# EAGLE design Design_Schematic (EAGLE 8.6.0)
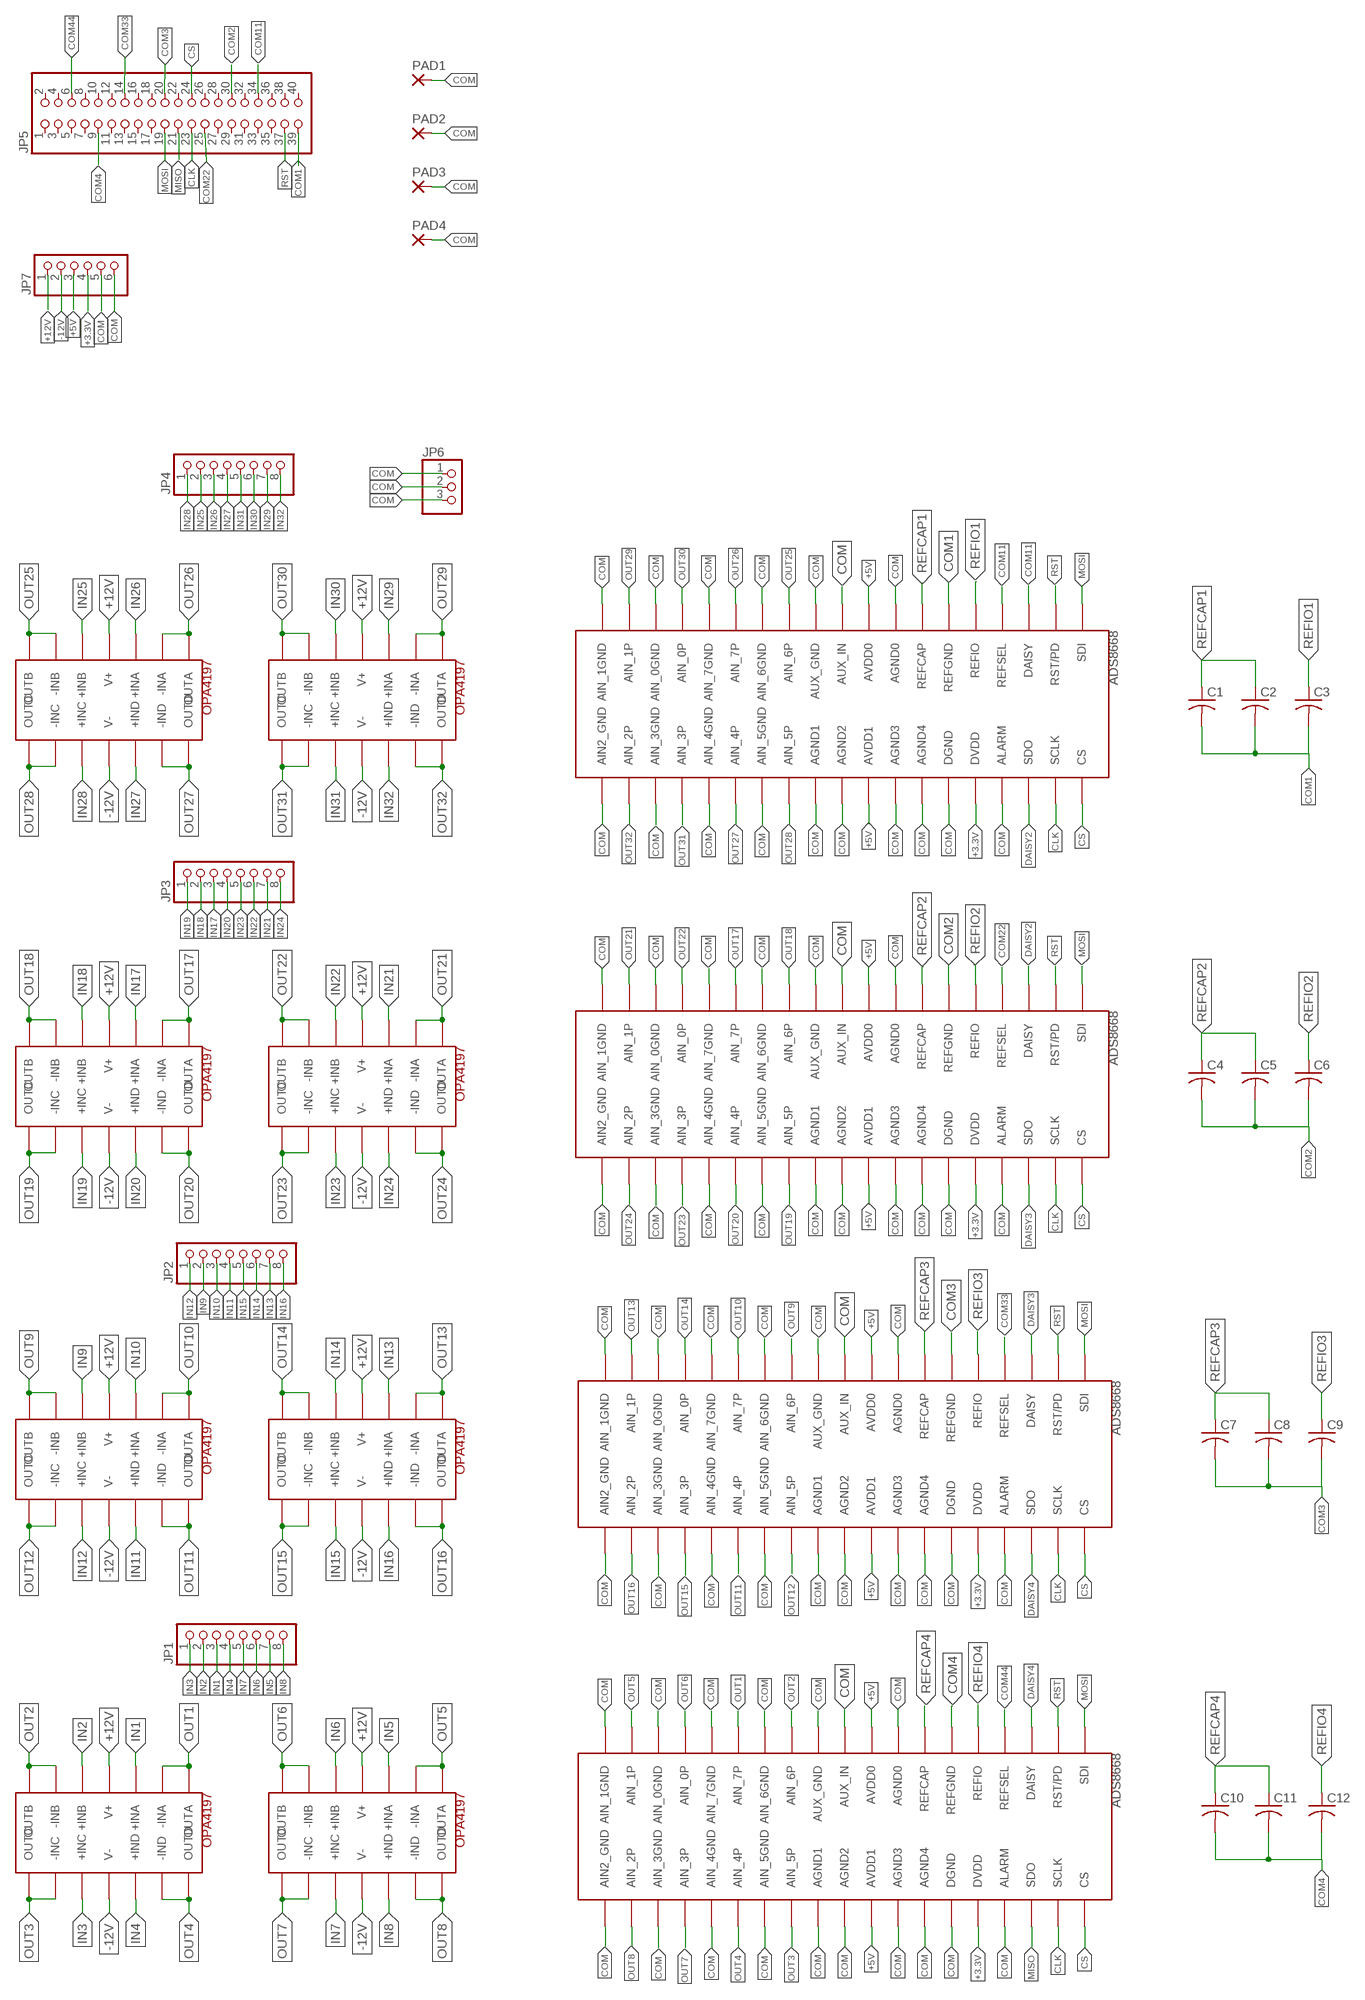
[diagram p0: schematic, sheet 1]

## Parts
ADC1  ADS8668  [ADS8668]
ADC2  ADS8668  [ADS8668]
ADC3  ADS8668  [ADS8668]
ADC4  ADS8668  [ADS8668]
C1  C-US025-030X050  [C025-030X050]
C2  C-US025-030X050  [C025-030X050]
C3  C-US025-030X050  [C025-030X050]
C4  C-US025-030X050  [C025-030X050]
C5  C-US025-030X050  [C025-030X050]
C6  C-US025-030X050  [C025-030X050]
C7  C-US025-030X050  [C025-030X050]
C8  C-US025-030X050  [C025-030X050]
C9  C-US025-030X050  [C025-030X050]
C10  C-US025-030X050  [C025-030X050]
C11  C-US025-030X050  [C025-030X050]
C12  C-US025-030X050  [C025-030X050]
JP1  PINHD-1X8CLEANBIG  [1X08-CLEANBIG]
JP2  PINHD-1X8CLEANBIG  [1X08-CLEANBIG]
JP3  PINHD-1X8CLEANBIG  [1X08-CLEANBIG]
JP4  PINHD-1X8CLEANBIG  [1X08-CLEANBIG]
JP5  PINHD-2X20  [2X20]
JP6  PINHD-1X3  [1X03]
JP7  PINHD-1X6  [1X06]
PAD1  3,17/1,3  [3,17/1,3]
PAD2  3,17/1,3  [3,17/1,3]
PAD3  3,17/1,3  [3,17/1,3]
PAD4  3,17/1,3  [3,17/1,3]
U$1  OPA4197  [OPA4197]
U$2  OPA4197  [OPA4197]
U$3  OPA4197  [OPA4197]
U$4  OPA4197  [OPA4197]
U$5  OPA4197  [OPA4197]
U$6  OPA4197  [OPA4197]
U$7  OPA4197  [OPA4197]
U$8  OPA4197  [OPA4197]

## Nets
+3.3V: ADC1.DVDD ADC2.DVDD ADC3.DVDD ADC4.DVDD JP7.4
+5V: ADC1.AVDD0 ADC1.AVDD1 ADC2.AVDD0 ADC2.AVDD1 ADC3.AVDD0 ADC3.AVDD1 ADC4.AVDD0 ADC4.AVDD1 JP7.3
+12V: JP7.1 U$1.V+ U$2.V+ U$3.V+ U$4.V+ U$5.V+ U$6.V+ U$7.V+ U$8.V+
-12V: JP7.2 U$1.V- U$2.V- U$3.V- U$4.V- U$5.V- U$6.V- U$7.V- U$8.V-
CLK: ADC1.SCLK ADC2.SCLK ADC3.SCLK ADC4.SCLK JP5.23
COM: ADC1.AGND0 ADC1.AGND1 ADC1.AGND2 ADC1.AGND3 ADC1.AGND4 ADC1.AIN2_GND ADC1.AIN6_GND(AIN_6GND) ADC1.AIN_0GND ADC1.AIN_1GND ADC1.AIN_3GND ADC1.AIN_4GND ADC1.AIN_5GND ADC1.AIN_7GND ADC1.ALARM ADC1.AUX_GND ADC1.AUX_IN ADC1.DGND ADC2.AGND0 ADC2.AGND1 ADC2.AGND2 ADC2.AGND3 ADC2.AGND4 ADC2.AIN2_GND ADC2.AIN6_GND(AIN_6GND) ADC2.AIN_0GND ADC2.AIN_1GND ADC2.AIN_3GND ADC2.AIN_4GND ADC2.AIN_5GND ADC2.AIN_7GND ADC2.ALARM ADC2.AUX_GND ADC2.AUX_IN ADC2.DGND ADC3.AGND0 ADC3.AGND1 ADC3.AGND2 ADC3.AGND3 ADC3.AGND4 ADC3.AIN2_GND ADC3.AIN6_GND(AIN_6GND) ADC3.AIN_0GND ADC3.AIN_1GND ADC3.AIN_3GND ADC3.AIN_4GND ADC3.AIN_5GND ADC3.AIN_7GND ADC3.ALARM ADC3.AUX_GND ADC3.AUX_IN ADC3.DGND ADC4.AGND0 ADC4.AGND1 ADC4.AGND2 ADC4.AGND3 ADC4.AGND4 ADC4.AIN2_GND ADC4.AIN6_GND(AIN_6GND) ADC4.AIN_0GND ADC4.AIN_1GND ADC4.AIN_3GND ADC4.AIN_4GND ADC4.AIN_5GND ADC4.AIN_7GND ADC4.ALARM ADC4.AUX_GND ADC4.AUX_IN ADC4.DGND JP6.1 JP6.2 JP6.3 JP7.5 JP7.6 PAD1.1(P) PAD2.1(P) PAD3.1(P) PAD4.1(P)
COM1: ADC4.REFGND C1.2 C2.2 C3.2 JP5.39
COM2: ADC1.REFGND C4.2 C5.2 C6.2 JP5.30
COM3: ADC2.REFGND C7.2 C8.2 C9.2 JP5.20
COM4: ADC3.REFGND C10.2 C11.2 C12.2 JP5.9
COM11: ADC4.DAISY ADC4.REFSEL JP5.34
COM22: ADC1.REFSEL JP5.25
COM33: ADC2.REFSEL JP5.14
COM44: ADC3.REFSEL JP5.6
CS: ADC1.CS ADC2.CS ADC3.CS ADC4.CS JP5.24
DAISY2: ADC1.DAISY ADC4.SDO
DAISY3: ADC1.SDO ADC2.DAISY
DAISY4: ADC2.SDO ADC3.DAISY
IN1: JP1.3 U$5.+INA
IN2: JP1.2 U$5.+INB
IN3: JP1.1 U$5.+INC
IN4: JP1.4 U$5.+IND
IN5: JP1.7 U$1.+INA
IN6: JP1.6 U$1.+INB
IN7: JP1.5 U$1.+INC
IN8: JP1.8 U$1.+IND
IN9: JP2.2 U$2.+INB
IN10: JP2.3 U$2.+INA
IN11: JP2.4 U$2.+IND
IN12: JP2.1 U$2.+INC
IN13: JP2.7 U$3.+INA
IN14: JP2.6 U$3.+INB
IN15: JP2.5 U$3.+INC
IN16: JP2.8 U$3.+IND
IN17: JP3.3 U$4.+INA
IN18: JP3.2 U$4.+INB
IN19: JP3.1 U$4.+INC
IN20: JP3.4 U$4.+IND
IN21: JP3.7 U$6.+INA
IN22: JP3.6 U$6.+INB
IN23: JP3.5 U$6.+INC
IN24: JP3.8 U$6.+IND
IN25: JP4.2 U$7.+INB
IN26: JP4.3 U$7.+INA
IN27: JP4.4 U$7.+IND
IN28: JP4.1 U$7.+INC
IN29: JP4.7 U$8.+INA
IN30: JP4.6 U$8.+INB
IN31: JP4.5 U$8.+INC
IN32: JP4.8 U$8.+IND
MISO: ADC3.SDO JP5.21
MOSI: ADC1.SDI ADC2.SDI ADC3.SDI ADC4.SDI JP5.19
OUT1: ADC3.AIN_7P U$5.-INA U$5.OUTA
OUT2: ADC3.AIN_6P U$5.-INB U$5.OUTB
OUT3: ADC3.AIN_5P U$5.-INC U$5.OUTC
OUT4: ADC3.AIN_4P U$5.-IND U$5.OUTD
OUT5: ADC3.AIN_1P U$1.-INA U$1.OUTA
OUT6: ADC3.AIN_0P U$1.-INB U$1.OUTB
OUT7: ADC3.AIN_3P U$1.-INC U$1.OUTC
OUT8: ADC3.AIN_2P U$1.-IND U$1.OUTD
OUT9: ADC2.AIN_6P U$2.-INB U$2.OUTB
OUT10: ADC2.AIN_7P U$2.-INA U$2.OUTA
OUT11: ADC2.AIN_4P U$2.-IND U$2.OUTD
OUT12: ADC2.AIN_5P U$2.-INC U$2.OUTC
OUT13: ADC2.AIN_1P U$3.-INA U$3.OUTA
OUT14: ADC2.AIN_0P U$3.-INB U$3.OUTB
OUT15: ADC2.AIN_3P U$3.-INC U$3.OUTC
OUT16: ADC2.AIN_2P U$3.-IND U$3.OUTD
OUT17: ADC1.AIN_7P U$4.-INA U$4.OUTA
OUT18: ADC1.AIN_6P U$4.-INB U$4.OUTB
OUT19: ADC1.AIN_5P U$4.-INC U$4.OUTC
OUT20: ADC1.AIN_4P U$4.-IND U$4.OUTD
OUT21: ADC1.AIN_1P U$6.-INA U$6.OUTA
OUT22: ADC1.AIN_0P U$6.-INB U$6.OUTB
OUT23: ADC1.AIN_3P U$6.-INC U$6.OUTC
OUT24: ADC1.AIN_2P U$6.-IND U$6.OUTD
OUT25: ADC4.AIN_6P U$7.-INB U$7.OUTB
OUT26: ADC4.AIN_7P U$7.-INA U$7.OUTA
OUT27: ADC4.AIN_4P U$7.-IND U$7.OUTD
OUT28: ADC4.AIN_5P U$7.-INC U$7.OUTC
OUT29: ADC4.AIN_1P U$8.-INA U$8.OUTA
OUT30: ADC4.AIN_0P U$8.-INB U$8.OUTB
OUT31: ADC4.AIN_3P U$8.-INC U$8.OUTC
OUT32: ADC4.AIN_2P U$8.-IND U$8.OUTD
REFCAP1: ADC4.REFCAP C1.1 C2.1
REFCAP2: ADC1.REFCAP C4.1 C5.1
REFCAP3: ADC2.REFCAP C7.1 C8.1
REFCAP4: ADC3.REFCAP C10.1 C11.1
REFIO1: ADC4.REFIO C3.1
REFIO2: ADC1.REFIO C6.1
REFIO3: ADC2.REFIO C9.1
REFIO4: ADC3.REFIO C12.1
RST: ADC1.RST/PD ADC2.RST/PD ADC3.RST/PD ADC4.RST/PD JP5.37
Unconnected: JP5.1 JP5.2 JP5.3 JP5.4 JP5.5 JP5.7 JP5.8 JP5.10 JP5.11 JP5.12 JP5.13 JP5.15 JP5.16 JP5.17 JP5.18 JP5.22 JP5.26 JP5.27 JP5.28 JP5.29 JP5.31 JP5.32 JP5.33 JP5.35 JP5.36 JP5.38 JP5.40

## Library data of the parts
ADC1-ADC4 = Design_Project:ADS8668: ADS8668 Analog Digital Converter - 8 Channels - 12 Bits of Resolution
C1-C12 = adafruit:C-US: CAPACITOR, American symbol
JP1-JP4 = adafruit:PINHD-1X8: PIN HEADER
JP5 = adafruit:PINHD-2X20: PIN HEADER
JP6 = adafruit:PINHD-1X3: PIN HEADER
JP7 = adafruit:PINHD-1X6: PIN HEADER
PAD1-PAD4 = wirepad:3,17/1,3: THROUGH-HOLE PAD
U$1-U$8 = Design_Project:OPA4197

## Board
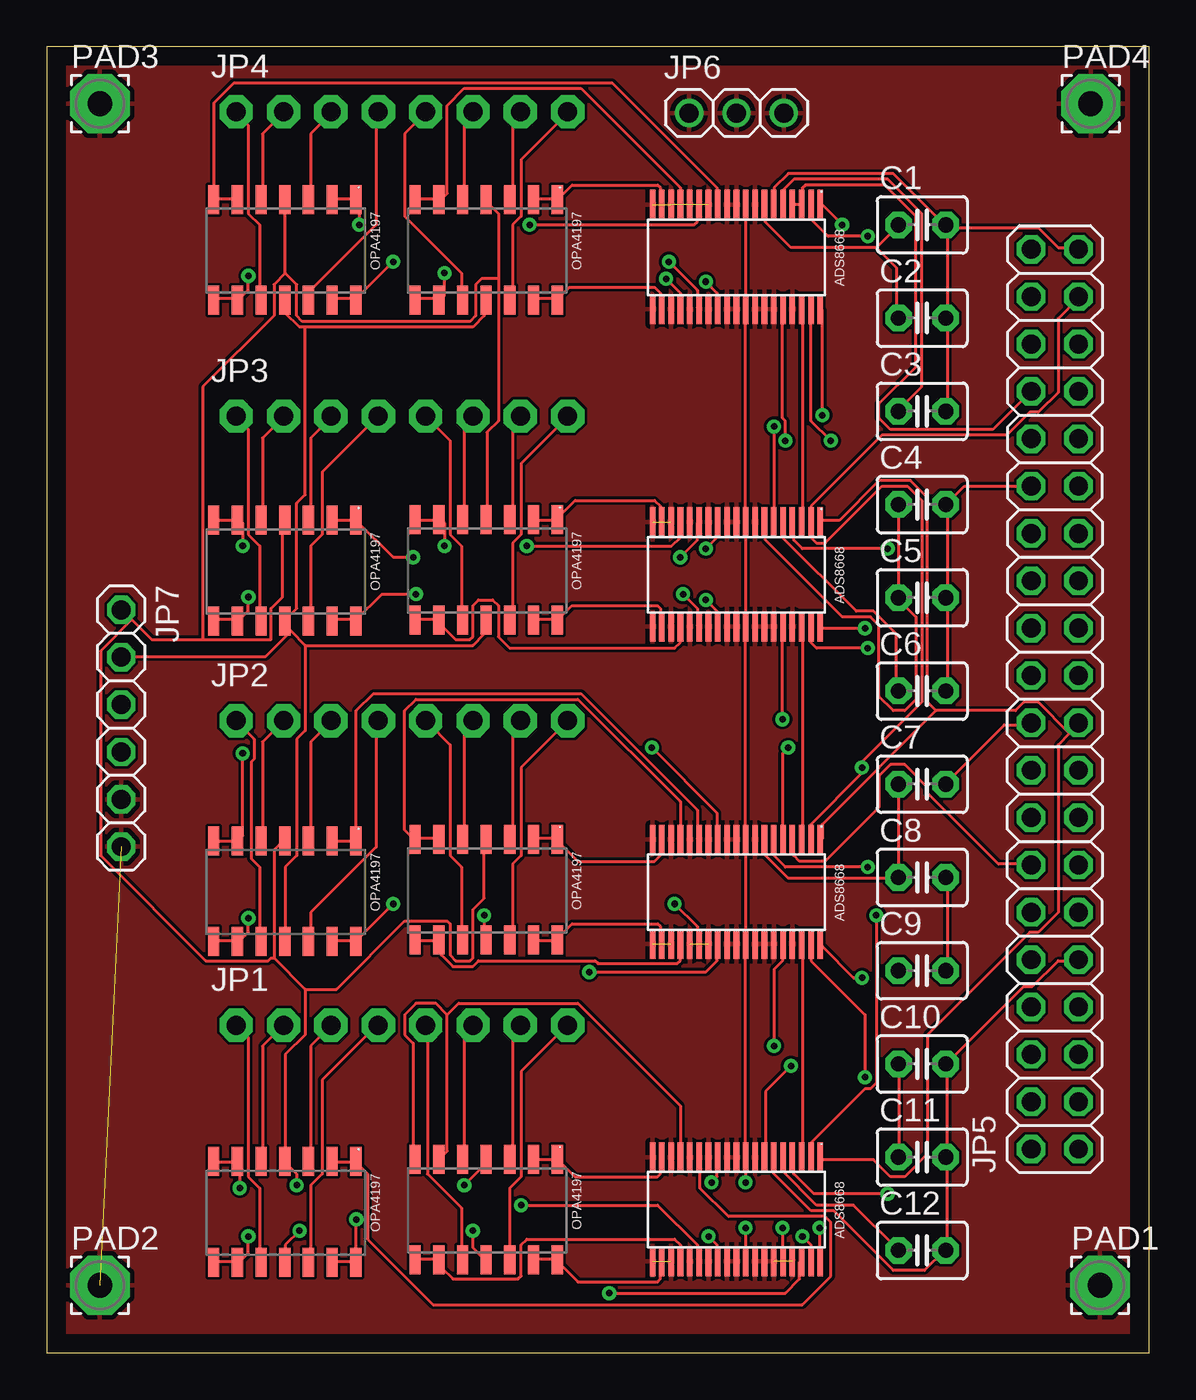
[diagram p1: board, top side]
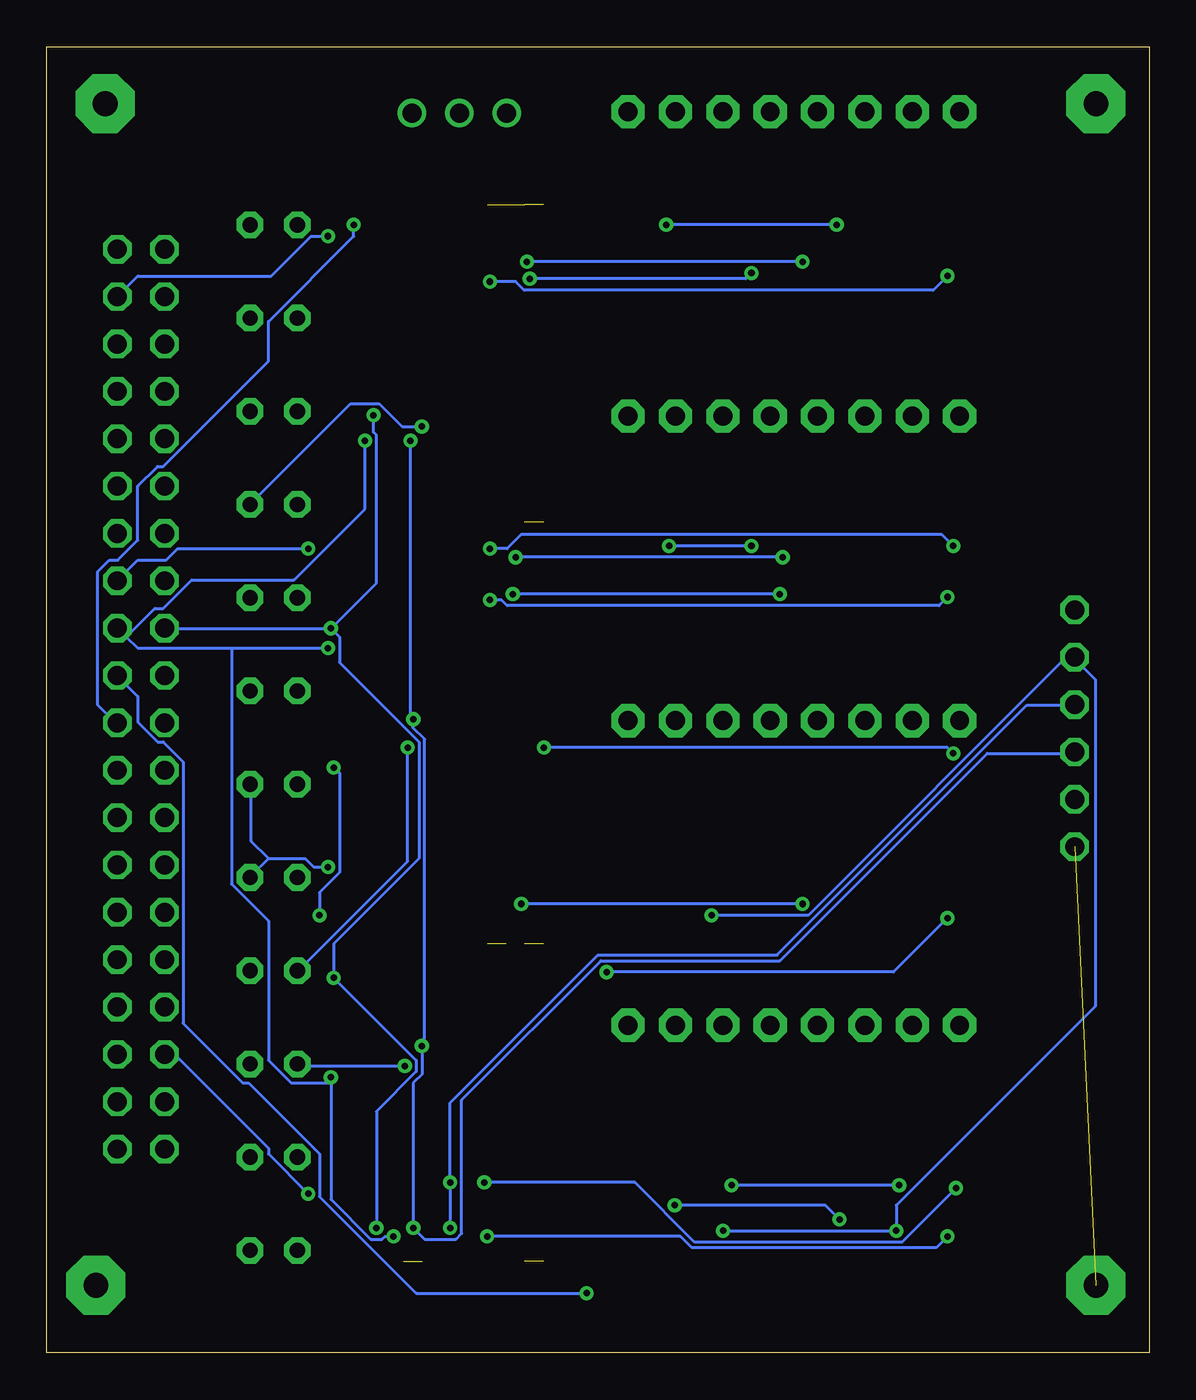
[diagram p2: board, bottom side, seen from below]

Size 59.14 x 70.06 mm. Coordinates in mm from the lower left corner, seen from the top.
Outline: 0,0 59.14,0 59.14,70.06 0,70.06 0,0
Copper layers (1+16): Top 0.035mm / dielectric 1.5mm / Bottom 0.035mm
Design rules "default *": minimum track width 6mil, minimum drill 0.35mm, track to track 6mil, track to pad 6mil, pad to pad 6mil, via to via 6mil, smd to smd 6mil, copper to edge 40mil, drill to drill 6mil, minimum pad ring 10mil, minimum via ring 8mil, stop-mask expansion 4mil, vias tented up to drill 0mil, thermal gap 10mil
vRestrict: area 8,61.5 to 17.5,63; area 8.1,55 to 17.5,56.8; area 19,61.5 to 28.2,63.1; area 18.9,55 to 28.4,56.8; area 8.1,44.3 to 17.6,46; area 8.2,38 to 17.5,39.6; area 19,44.3 to 28.2,46.1; area 18.9,37.8 to 28.5,39.8; area 8.2,27.1 to 17.6,28.8; area 18.9,27.1 to 28.2,29; area 8.1,20.3 to 17.7,22.4; area 18.8,20.4 to 28.5,22.5; 84 more areas

### Footprints (pad centres in the part's own frame; a part is rotated, then mirrored left to right if it is on the bottom)
ADS8668 = smd 0.3 x 1.6: AGND0 3.5,0; AGND1 5,5.6; AGND2 4.5,5.6; AGND3 3.5,5.6; AGND4 3,5.6; AIN2_GND 9,5.6; AIN6_GND 6,0; AIN_0GND 8,0; AIN_0P 7.5,0; AIN_1GND 9,0; AIN_1P 8.5,0; AIN_2P 8.5,5.6; AIN_3GND 8,5.6; AIN_3P 7.5,5.6; AIN_4GND 7,5.6; AIN_4P 6.5,5.6; AIN_5GND 6,5.6; AIN_5P 5.5,5.6; AIN_6P 5.5,0; AIN_7GND 7,0; AIN_7P 6.5,0; ALARM 1.5,5.6; AUX_GND 5,0; AUX_IN 4.5,0; AVDD0 4,0; AVDD1 4,5.6; CS 0,5.6; DAISY 1,0; DGND 2.5,5.6; DVDD 2,5.6; REFCAP 3,0; REFGND 2.5,0; REFIO 2,0; REFSEL 1.5,0; RST/PD 0.5,0; SCLK 0.5,5.6; SDI 0,0; SDO 1,5.6
C025-030X050 = drill 0.813 pad 1.422 octagon: 1 -1.27,0; 2 1.27,0
1X08-CLEANBIG = drill 1.016 pad 1.778 octagon: 1 -8.89,0; 2 -6.35,0; 3 -3.81,0; 4 -1.27,0; 5 1.27,0; 6 3.81,0; 7 6.35,0; 8 8.89,0
2X20 = drill 1.016 octagon: 1 -24.13,-1.27; 2 -24.13,1.27; 3 -21.59,-1.27; 4 -21.59,1.27; 5 -19.05,-1.27; 6 -19.05,1.27; 7 -16.51,-1.27; 8 -16.51,1.27; 9 -13.97,-1.27; 10 -13.97,1.27; 11 -11.43,-1.27; 12 -11.43,1.27; 13 -8.89,-1.27; 14 -8.89,1.27; 15 -6.35,-1.27; 16 -6.35,1.27; 17 -3.81,-1.27; 18 -3.81,1.27; 19 -1.27,-1.27; 20 -1.27,1.27; 21 1.27,-1.27; 22 1.27,1.27; 23 3.81,-1.27; 24 3.81,1.27; 25 6.35,-1.27; 26 6.35,1.27; 27 8.89,-1.27; 28 8.89,1.27; 29 11.43,-1.27; 30 11.43,1.27; 31 13.97,-1.27; 32 13.97,1.27; 33 16.51,-1.27; 34 16.51,1.27; 35 19.05,-1.27; 36 19.05,1.27; 37 21.59,-1.27; 38 21.59,1.27; 39 24.13,-1.27; 40 24.13,1.27
1X03 = drill 1.016: 1 -2.54,0; 2 0,0; 3 2.54,0
1X06 = drill 1.016 octagon: 1 -6.35,0; 2 -3.81,0; 3 -1.27,0; 4 1.27,0; 5 3.81,0; 6 6.35,0
3,17/1,3 = drill 1.321 pad 3.175 octagon: 1 0,0
OPA4197 = smd 0.6 x 1.55: +INA 3.175,-0.508; +INB 5.715,-0.508; +INC 5.715,4.892; +IND 3.175,4.892; -INA 1.905,-0.508; -INB 6.985,-0.508; -INC 6.985,4.892; -IND 1.905,4.892; OUTA 0.635,-0.508; OUTB 8.255,-0.508; OUTC 8.255,4.892; OUTD 0.635,4.892; V+ 4.445,-0.508; V- 4.445,4.892

### Placement (x,y rotation side)
ADC1  41.5,44.55 180 top
ADC2  41.5,27.53 180 top
ADC3  41.5,10.5 180 top
ADC4  41.5,61.58 180 top
C1  46.96,60.5 0 top
C2  46.96,55.5 0 top
C3  46.96,50.5 0 top
C4  46.96,45.5 0 top
C5  46.96,40.5 0 top
C6  46.96,35.5 0 top
C7  46.96,30.5 0 top
C8  46.96,25.5 0 top
C9  46.96,20.5 0 top
C10  46.96,15.5 0 top
C11  46.96,10.5 0 top
C12  46.96,5.5 0 top
JP1  19.06,17.58 0 top
JP2  19.06,33.91 0 top
JP3  19.06,50.23 0 top
JP4  19.06,66.56 0 top
JP5  54.08,35.06 90 top
JP6  37,66.5 0 top
JP7  4,33.5 270 top
PAD1  56.5,3.63 0 top
PAD2  2.86,3.63 0 top
PAD3  2.86,67 0 top
PAD4  56,67 0 top
U$1  28.02,9.88 180 top
U$2  17.22,26.96 180 top
U$3  28.02,27.04 180 top
U$4  17.22,44.15 180 top
U$5  17.22,9.76 180 top
U$6  28.02,44.19 180 top
U$7  17.22,61.35 180 top
U$8  28.02,61.35 180 top

### Tracks (layer width: path | path; a pad name or v marks a point on that pad's centre or on a via)
+3.3V  (via drill 0.35)
  Top 0.152: v39.47,6.71 39.47,5.03 ADC3.DVDD | v39.01,16.46 39.01,20.57 39.47,21.03 39.47,21.79 ADC2.DVDD | v39.47,33.98 39.47,38.86 ADC1.DVDD | v39.62,48.92 39.62,49.99 39.47,50.14 39.47,55.93 ADC4.DVDD
  Bottom 0.152: v39.62,48.92 39.62,34.14 v39.47,33.98 39.47,33.53 38.86,32.92 38.86,16.61 v39.01,16.46 39.01,14.94 39.47,14.48 v39.47,6.71 38.86,6.1 37.19,6.1 36.88,6.4 36.88,13.56 29.41,21.03 19.81,21.03 8.69,32.16 4.12,32.16 JP7.4
+5V  (via drill 0.35)
  Top 0.152: ADC4.AVDD0 37.49,56.08 ADC4.AVDD1 37.49,55.93 37.49,44.65 ADC1.AVDD0 37.49,44.5 37.49,39.01 ADC1.AVDD1 37.49,38.86 37.49,27.58 ADC2.AVDD0 37.49,27.43 37.49,21.95 ADC2.AVDD1 37.49,21.79 37.49,10.52 ADC3.AVDD0 37.49,10.36 v37.49,9.14 | v37.49,6.71 37.49,5.03 ADC3.AVDD1
  Bottom 0.152: v37.49,6.71 v37.49,9.14 37.49,13.41 29.57,21.34 19.96,21.34 6.55,34.75 4.12,34.75 JP7.3
+12V  (via drill 0.35)
  Top 0.152: 13.87,19.51 13.87,17.07 12.8,16 12.8,10.36 U$5.V+ 12.8,10.21 13.41,9.6 v13.41,8.99 | 12.19,21.18 13.87,19.51 | 12.19,21.18 12.19,26.98 12.65,27.43 U$2.V+ | v22.4,8.99 23.47,10.06 23.47,10.36 U$1.V+ | 13.87,19.51 15.54,19.51 19.2,23.16 21.49,23.16 21.64,23.01 21.64,21.34 21.95,21.03 22.71,21.03 22.86,21.18 22.86,23.77 23.47,24.38 23.47,27.43 U$3.V+ | 8.38,38.25 5.64,38.25 4.57,39.32 | 8.38,38.25 12.04,38.25 12.04,39.93 12.65,40.54 12.65,44.65 U$4.V+ | 4.57,39.32 4.12,39.78 JP7.1 | 24.23,57.61 24.23,61.11 23.62,61.72 U$8.V+ | 24.23,57.61 24.23,49.99 23.62,49.38 23.62,44.81 U$6.V+ | 12.8,57.91 12.8,61.72 U$7.V+ | 12.8,57.91 13.41,57.3 13.41,55.63 13.72,55.32 22.71,55.32 23.01,55.63 23.01,57.3 23.32,57.61 24.23,57.61 | 8.38,38.25 8.38,51.82 12.19,55.63 12.19,57.3 12.8,57.91 | 12.19,21.18 12.04,21.18 11.89,21.03 8.53,21.03 2.9,26.67 2.9,37.64 4.57,39.32
  Bottom 0.152: v13.41,8.99 v22.4,8.99
-12V  (via drill 0.35)
  Top 0.152: 13.87,55.02 22.86,55.02 23.47,55.63 23.47,56.39 U$8.V- | 13.87,55.02 13.56,55.02 12.8,55.78 12.8,56.39 U$7.V- | 13.87,37.95 13.87,33.38 13.41,32.92 13.41,26.67 12.8,26.06 12.8,22.1 U$2.V- | 13.11,38.71 12.65,39.17 U$4.V- 12.8,39.32 13.41,39.93 13.41,45.57 13.87,46.02 13.87,55.02 | 13.11,38.71 13.87,37.95 | 13.87,37.95 22.86,37.95 23.47,38.56 23.47,39.17 U$6.V- | v13.56,6.55 12.8,5.79 12.8,4.88 U$5.V- | v22.86,6.55 22.86,5.64 23.47,5.03 U$1.V- | v23.47,23.47 23.47,22.25 U$3.V- | 13.11,38.71 11.73,37.34 4.12,37.34 JP7.2
  Bottom 0.152: v22.86,6.55 v13.56,6.55 13.56,7.92 2.9,18.59 2.9,36.12 3.96,37.19 JP7.2 4.12,37.19 4.57,37.19 18.29,23.47 v23.47,23.47
CLK  (via drill 0.35)
  Top 0.152: v40.54,6.25 41,5.79 41,5.03 ADC3.SCLK | v43.89,14.78 43.89,18.14 41,21.03 41,21.79 ADC2.SCLK | v44.04,37.8 41.3,37.8 41,38.1 41,38.86 ADC1.SCLK | v42.06,48.92 41,49.99 41,55.93 ADC4.SCLK
  Bottom 0.152: v40.54,6.25 41,6.25 41.15,6.1 41.76,6.1 43.89,8.23 43.89,14.48 | 49.23,37.8 54.25,37.8 54.86,38.41 | 49.23,37.8 v44.04,37.8 | 54.86,38.41 55.32,38.86 JP5.23 54.86,38.41 | v42.06,48.92 42.06,45.26 45.87,41.45 51.36,41.45 52.88,39.93 53.34,39.93 54.86,38.41 | 43.89,14.48 46.02,14.48 47.24,15.7 47.24,23.16 49.23,25.15 49.23,37.8 | 43.89,14.48 v43.89,14.78
COM  (9 unrouted)
  pour Top: -4,72.5 -4,0 -0.5,-3.5 68.5,-3.5 68.5,72.5 67,74 65,76 0.5,76 -0.5,76
COM1
  Top 0.152: C3.2 48.31,50.6 48.31,55.47 C2.2 48.31,55.63 48.31,60.35 | ADC4.REFGND 39.01,61.72 39.01,62.48 39.78,63.25 45.41,63.25 48.16,60.5 C1.2 48.31,60.35 | 48.31,60.35 53.19,60.35 54.25,59.28 55.32,59.28 JP5.39
COM2  (via drill 0.35)
  Top 0.152: C6.2 48.31,35.51 48.31,40.39 C5.2 48.31,40.54 48.31,45.41 C4.2 48.31,45.57 49.23,46.48 52.73,46.48 JP5.30 | v39.01,49.68 39.01,44.65 ADC1.REFGND
  Bottom 0.152: v39.01,49.68 40.08,49.68 41.3,50.9 42.82,50.9 48.16,45.57 C4.2
COM3  (via drill 0.35)
  Top 0.152: v44.04,26.06 39.62,26.06 39.01,26.67 39.01,27.43 ADC2.REFGND | C9.2 48.31,20.57 48.31,25.45 C8.2 | JP5.20 52.73,33.68 51.36,33.68 48.31,30.63 C7.2
  Bottom 0.152: v44.04,26.06 44.81,26.06 45.26,26.52 47.24,26.52 | 47.24,26.52 48.16,25.6 C8.2 | 47.24,26.52 48.16,27.43 48.16,30.48 C7.2
COM4
  Top 0.152: ADC3.REFGND 39.01,10.36 39.01,9.6 41,7.62 42.22,7.62 45.41,4.42 47.09,4.42 48.16,5.49 C12.2 48.31,5.64 48.31,10.36 C11.2 48.31,10.52 48.31,15.39 C10.2 48.31,15.54 52.43,19.66 52.88,19.66 54.25,21.03 55.32,21.03 JP5.9
COM11
  Top 0.152: ADC4.REFSEL 40.08,61.57 40.39,61.57 ADC4.DAISY 40.54,61.72 40.54,62.48 40.69,62.64 44.96,62.64 46.63,60.96 46.63,52.88 44.65,50.9 44.65,50.14 45.26,49.53 50.75,49.53 52.73,51.51 JP5.34
COM22  (via drill 0.35)
  Top 0.152: v45.11,43.13 40.54,43.13 40.08,43.59 40.08,44.5 ADC1.REFSEL
  Bottom 0.152: v45.11,43.13 52.12,43.13 52.73,42.52 54.25,42.52 55.32,41.45 JP5.25
COM33
  Top 0.152: ADC2.REFSEL 40.08,27.43 40.08,26.67 40.39,26.36 41.76,26.36 44.65,29.26 44.65,30.94 45.26,31.55 46.02,31.55 47.24,30.33 47.24,30.02 51.05,26.21 52.73,26.21 JP5.14
COM44  (via drill 0.35)
  Top 0.152: v45.11,8.53 41.15,8.53 40.08,9.6 40.08,10.36 ADC3.REFSEL
  Bottom 0.152: v45.11,8.53 47.24,10.67 47.24,10.97 52.27,16 52.73,16 JP5.6
CS  (via drill 0.35)
  Top 0.152: v41.45,6.71 41.45,5.03 ADC3.CS | v43.74,20.12 43.28,20.12 41.6,21.79 ADC2.CS | v43.89,38.86 41.6,38.86 ADC1.CS | v41.6,50.29 41.6,55.93 ADC4.CS
  Bottom 0.152: v41.45,6.71 41.45,12.95 39.32,15.09 39.32,15.7 v43.74,20.12 43.74,21.95 39.17,26.52 39.17,32.77 43.43,37.03 43.43,38.41 v43.89,38.86 | v43.89,38.86 52.73,38.86 JP5.24 | v41.6,50.29 41.6,49.38 41.45,49.23 41.45,41.3 v43.89,38.86
DAISY2
  Top 0.152: ADC1.DAISY 40.54,44.65 40.54,55.93 ADC4.SDO
DAISY3
  Top 0.152: ADC2.DAISY 40.54,27.58 40.54,38.86 ADC1.SDO
DAISY4
  Top 0.152: ADC3.DAISY 40.54,10.52 40.54,21.79 ADC2.SDO
IN1
  Top 0.152: U$5.+INA 14.17,10.36 14.17,16.46 15.24,17.53 JP1.3
IN2
  Top 0.152: U$5.+INB 11.58,10.36 11.58,16.46 12.65,17.53 JP1.2
IN3
  Top 0.152: U$5.+INC 11.43,4.88 11.43,8.84 10.82,9.45 10.82,16.92 10.21,17.53 JP1.1
IN4
  Top 0.152: U$5.+IND 14.17,4.88 14.17,8.99 14.78,9.6 14.78,14.63 17.68,17.53 JP1.4
IN5
  Top 0.152: U$1.+INA 24.99,10.52 24.99,17.22 25.3,17.53 JP1.7
IN6
  Top 0.152: U$1.+INB 22.4,10.52 22.4,17.07 22.86,17.53 JP1.6
IN7
  Top 0.152: U$1.+INC 22.25,5.03 22.25,7.77 20.42,9.6 20.42,17.53 JP1.5
IN8
  Top 0.152: U$1.+IND 24.84,5.03 24.84,8.84 25.45,9.45 25.45,15.09 27.89,17.53 JP1.8
IN9
  Top 0.152: U$2.+INB 11.58,27.58 11.58,32.77 12.65,33.83 JP2.2
IN10
  Top 0.152: U$2.+INA 14.17,27.58 14.17,32.77 15.24,33.83 JP2.3
IN11
  Top 0.152: U$2.+IND 14.17,22.1 14.17,23.62 17.68,27.13 17.68,33.83 JP2.4
IN12
  Top 0.152: U$2.+INC 11.43,22.1 11.43,26.06 10.97,26.52 10.97,31.7 11.12,31.85 11.12,32.92 10.21,33.83 JP2.1
IN13
  Top 0.152: U$3.+INA 24.99,27.58 24.99,33.53 25.3,33.83 JP2.7
IN14
  Top 0.152: U$3.+INB 22.4,27.58 22.4,33.38 22.86,33.83 JP2.6
IN15
  Top 0.152: U$3.+INC 22.25,22.25 22.25,26.06 21.64,26.67 21.64,32.61 20.42,33.83 JP2.5
IN16
  Top 0.152: U$3.+IND 24.99,22.25 24.99,26.21 25.45,26.67 25.45,31.39 27.89,33.83 JP2.8
IN17
  Top 0.152: U$4.+INA 14.17,44.81 14.17,49.07 15.24,50.14 JP3.3
IN18
  Top 0.152: U$4.+INB 11.58,44.81 11.58,49.07 12.65,50.14 JP3.2
IN19
  Top 0.152: U$4.+INC 11.43,39.32 11.43,43.28 10.82,43.89 10.82,49.53 10.21,50.14 JP3.1
IN20
  Top 0.152: U$4.+IND 14.17,39.32 14.17,43.28 14.78,43.89 14.78,47.24 17.68,50.14 JP3.4
IN21
  Top 0.152: U$6.+INA 24.99,44.81 24.99,49.84 25.3,50.14 JP3.7
IN22
  Top 0.152: U$6.+INB 22.4,44.81 22.4,49.68 22.86,50.14 JP3.6
IN23
  Top 0.152: U$6.+INC 22.25,39.32 22.25,43.28 21.64,43.89 21.64,48.92 20.42,50.14 JP3.5
IN24
  Top 0.152: U$6.+IND 24.99,39.32 24.99,43.43 25.45,43.89 25.45,47.7 27.89,50.14 JP3.8
IN25
  Top 0.152: U$7.+INB 11.58,61.87 11.58,65.38 12.65,66.45 JP4.2
IN26
  Top 0.152: U$7.+INA 14.17,61.87 14.17,65.38 15.24,66.45 JP4.3
IN27
  Top 0.152: U$7.+IND 14.17,56.54 14.17,57 17.68,60.5 17.68,66.45 JP4.4
IN28
  Top 0.152: U$7.+INC 11.43,56.54 11.43,60.5 10.82,61.11 10.82,65.84 10.21,66.45 JP4.1
IN29
  Top 0.152: U$8.+INA 24.99,61.87 24.99,66.14 25.3,66.45 JP4.7
IN30
  Top 0.152: U$8.+INB 22.4,61.87 22.4,65.99 22.86,66.45 JP4.6
IN31
  Top 0.152: U$8.+INC 22.25,56.54 22.25,57.91 19.2,60.96 19.2,65.38 20.27,66.45 JP4.5
IN32
  Top 0.152: U$8.+IND 24.99,56.54 24.99,60.5 25.45,60.96 25.45,64.01 27.89,66.45 JP4.8
MISO  (via drill 0.35)
  Top 0.152: v30.18,3.2 39.62,3.2 40.39,3.96 40.39,4.88 ADC3.SDO
  Bottom 0.152: v30.18,3.2 39.32,3.2 44.5,8.38 44.5,10.67 48.31,14.48 48.62,14.48 51.82,17.68 51.82,31.7 52.88,32.77 53.19,32.77 54.25,33.83 54.25,35.2 55.32,36.27 JP5.21
MOSI  (via drill 0.35)
  Top 0.152: 54.86,33.22 55.32,33.68 JP5.19 54.86,33.22 | 54.86,33.22 54.25,32.61 54.25,23.62 53.19,22.55 52.73,22.55 47.24,17.07 47.24,10.67 46.02,9.45 45.26,9.45 44.35,10.36 41.6,10.36 ADC3.SDI | 47.7,34.44 41.6,28.35 41.6,27.58 ADC2.SDI | 47.7,34.44 51.97,34.44 52.43,34.9 53.19,34.9 54.86,33.22 | 47.7,34.44 47.24,34.9 47.24,45.87 46.33,46.79 44.65,46.79 42.52,44.65 41.6,44.65 ADC1.SDI | v42.67,60.5 41.6,61.57 ADC4.SDI
  Bottom 0.152: v42.67,60.5 42.67,59.89 47.24,55.32 47.24,53.19 52.88,47.55 53.19,47.55 54.25,46.48 54.25,43.59 55.32,42.52 55.78,42.52 56.39,41.91 56.39,34.75 55.47,33.83 JP5.19
OUT1
  Top 0.152: U$5.-INA 15.39,10.21 16.46,10.21 U$5.OUTA 16.61,10.21 17.22,9.6 17.22,6.1 20.73,2.59 40.54,2.59 42.06,4.12 42.06,7.01 41.76,7.32 36.58,7.32 35.05,8.84 35.05,10.36 ADC3.AIN_7P
OUT2  (via drill 0.35)
  Top 0.152: U$5.OUTB 8.99,10.21 10.21,10.21 U$5.-INB 10.36,10.21 v10.36,8.84 | v35.66,9.14 35.97,9.45 35.97,10.36 ADC3.AIN_6P
  Bottom 0.152: v35.66,9.14 27.58,9.14 24.38,5.94 13.26,5.94 v10.36,8.84
OUT3  (via drill 0.35)
  Top 0.152: U$5.OUTC 8.99,4.88 10.21,4.88 U$5.-INC 10.36,4.88 10.82,5.33 v10.82,6.25 | v35.51,6.25 35.97,5.79 35.97,5.03 ADC3.AIN_5P
  Bottom 0.152: v35.51,6.25 25.15,6.25 24.54,5.64 11.43,5.64 v10.82,6.25
OUT4  (via drill 0.35)
  Top 0.152: U$5.-IND 15.39,4.88 16.46,4.88 U$5.OUTD 16.61,4.88 v16.61,7.16 | v25.45,7.92 32.77,7.92 34.9,5.79 34.9,5.03 ADC3.AIN_4P
  Bottom 0.152: v25.45,7.92 17.37,7.92 v16.61,7.16
OUT5
  Top 0.152: U$1.-INA 26.21,10.36 27.28,10.36 U$1.OUTA 27.43,10.36 28.35,9.45 32.77,9.45 32.92,9.6 32.92,10.36 ADC3.AIN_1P
OUT6
  Top 0.152: 21.49,18.14 20.88,18.75 19.81,18.75 19.2,18.14 19.2,17.07 19.66,16.61 19.66,10.52 U$1.OUTB | 21.49,18.14 21.49,10.82 21.18,10.52 U$1.-INB | 21.49,18.14 22.1,18.75 28.5,18.75 33.98,13.26 33.98,10.52 ADC3.AIN_0P
OUT7
  Top 0.152: U$1.OUTC 19.81,5.03 21.03,5.03 U$1.-INC 21.18,4.88 21.18,4.57 21.79,3.96 25.3,3.96 25.45,4.12 25.45,5.79 25.76,6.1 33.68,6.1 33.98,5.79 33.98,5.03 ADC3.AIN_3P
OUT8
  Top 0.152: U$1.-IND 26.21,5.03 27.28,5.03 U$1.OUTD 27.43,4.88 28.5,3.81 32.77,3.81 32.92,3.96 32.92,4.88 ADC3.AIN_2P
OUT9  (via drill 0.35)
  Top 0.152: U$2.OUTB 8.99,27.43 10.21,27.43 U$2.-INB 10.36,27.58 10.52,27.74 v10.52,32.16 | v32.46,32.46 35.97,28.96 35.97,27.58 ADC2.AIN_6P
  Bottom 0.152: v32.46,32.46 10.82,32.46 v10.52,32.16
OUT10
  Top 0.152: U$2.-INA 15.39,27.43 16.46,27.43 U$2.OUTA 16.61,27.58 16.61,34.44 17.53,35.36 28.65,35.36 34.9,29.11 34.9,27.58 ADC2.AIN_7P
OUT11  (via drill 0.35)
  Top 0.152: U$2.-IND 15.39,22.1 16.46,22.1 U$2.OUTD 16.61,22.1 v18.59,24.08 | v33.68,24.08 34.9,22.86 34.9,21.95 ADC2.AIN_4P
  Bottom 0.152: v18.59,24.08 v33.68,24.08
OUT12  (via drill 0.35)
  Top 0.152: U$2.OUTC 8.99,22.1 10.21,22.1 U$2.-INC 10.36,22.1 10.82,22.55 v10.82,23.32 | v29.11,20.42 35.36,20.42 35.97,21.03 35.97,21.79 ADC2.AIN_5P
  Bottom 0.152: v29.11,20.42 13.72,20.42 v10.82,23.32
OUT13
  Top 0.152: U$3.-INA 26.21,27.58 27.28,27.58 U$3.OUTA 27.43,27.43 28.5,26.36 32.61,26.36 32.92,26.67 32.92,27.43 ADC2.AIN_1P
OUT14
  Top 0.152: U$3.-INB 21.03,27.58 19.81,27.58 U$3.OUTB 19.66,27.58 19.2,28.04 19.2,34.44 19.81,35.05 28.5,35.05 33.98,29.57 33.98,27.58 ADC2.AIN_0P
OUT15
  Top 0.152: U$3.OUTC 19.81,22.1 21.03,22.1 U$3.-INC 21.18,22.1 21.18,21.34 21.79,20.73 22.86,20.73 23.16,21.03 29.41,21.03 29.57,20.88 33.83,20.88 33.98,21.03 33.98,21.79 ADC2.AIN_3P
OUT16
  Top 0.152: U$3.-IND 26.21,22.1 27.28,22.1 U$3.OUTD 27.43,22.25 28.19,23.01 32.77,23.01 32.92,22.86 32.92,21.95 ADC2.AIN_2P
OUT17  (via drill 0.35)
  Top 0.152: U$4.-INA 15.39,44.65 16.46,44.65 U$4.OUTA 16.61,44.65 18.59,42.67 v19.66,42.67 | v33.98,42.67 34.9,43.59 34.9,44.5 ADC1.AIN_7P
  Bottom 0.152: v19.66,42.67 v33.98,42.67
OUT18  (via drill 0.35)
  Top 0.152: U$4.OUTB 8.99,44.65 10.21,44.65 U$4.-INB 10.36,44.65 10.52,44.5 v10.52,43.28 | v35.36,43.13 35.97,43.74 35.97,44.5 ADC1.AIN_6P
  Bottom 0.152: v35.36,43.13 34.44,43.13 33.68,43.89 11.12,43.89 v10.52,43.28
OUT19  (via drill 0.35)
  Top 0.152: U$4.OUTC 8.99,39.32 10.21,39.32 U$4.-INC 10.36,39.32 10.82,39.78 v10.82,40.54 | v35.36,40.39 35.97,39.78 35.97,39.01 ADC1.AIN_5P
  Bottom 0.152: v35.36,40.39 34.75,40.39 34.44,40.08 11.28,40.08 v10.82,40.54
OUT20  (via drill 0.35)
  Top 0.152: U$4.-IND 15.39,39.32 16.46,39.32 U$4.OUTD 16.61,39.32 17.98,40.69 v19.81,40.69 | v34.14,40.69 34.9,39.93 34.9,39.01 ADC1.AIN_4P
  Bottom 0.152: v19.81,40.69 v34.14,40.69
OUT21
  Top 0.152: U$6.-INA 26.21,44.65 27.28,44.65 U$6.OUTA 27.43,44.81 28.35,45.72 32.61,45.72 32.92,45.41 32.92,44.65 ADC1.AIN_1P
OUT22  (via drill 0.35)
  Top 0.152: U$6.OUTB 19.81,44.65 21.03,44.65 U$6.-INB 21.18,44.65 21.34,44.5 v21.34,43.28 | v25.76,43.28 33.53,43.28 33.98,43.74 33.98,44.5 ADC1.AIN_0P
  Bottom 0.152: v21.34,43.28 v25.76,43.28
OUT23
  Top 0.152: U$6.OUTC 19.81,39.32 21.03,39.32 U$6.-INC 21.03,39.17 21.95,38.25 22.71,38.25 22.86,38.41 22.86,40.08 23.16,40.39 23.93,40.39 24.23,40.08 24.23,38.41 24.84,37.8 33.68,37.8 33.98,38.1 33.98,38.86 ADC1.AIN_3P
OUT24
  Top 0.152: U$6.-IND 26.21,39.32 27.28,39.32 U$6.OUTD 27.43,39.32 28.19,40.08 32.77,40.08 32.92,39.93 32.92,39.01 ADC1.AIN_2P
OUT25
  Top 0.152: 8.99,61.87 10.21,61.87 U$7.-INB | 8.99,61.87 8.99,67.06 10.06,68.12 30.33,68.12 35.97,62.48 35.97,61.72 ADC4.AIN_6P | 8.99,61.87 U$7.OUTB
OUT26  (via drill 0.35)
  Top 0.152: U$7.-INA 15.39,61.87 16.46,61.87 U$7.OUTA 16.61,61.72 16.76,61.57 v16.76,60.5 | v25.91,60.5 34.75,60.5 34.9,60.66 34.9,61.57 ADC4.AIN_7P
  Bottom 0.152: v16.76,60.5 v25.91,60.5
OUT27  (via drill 0.35)
  Top 0.152: U$7.-IND 15.39,56.54 16.46,56.54 U$7.OUTD 16.61,56.54 v18.59,58.52 | v33.38,58.52 34.9,57 34.9,56.08 ADC4.AIN_4P
  Bottom 0.152: v18.59,58.52 v33.38,58.52
OUT28  (via drill 0.35)
  Top 0.152: U$7.OUTC 8.99,56.54 10.21,56.54 U$7.-INC 10.36,56.54 10.82,57 v10.82,57.76 | v35.36,57.45 35.97,56.84 35.97,56.08 ADC4.AIN_5P
  Bottom 0.152: v35.36,57.45 33.98,57.45 33.53,57 11.58,57 v10.82,57.76
OUT29
  Top 0.152: U$8.-INA 26.21,61.87 27.28,61.87 U$8.OUTA 27.43,61.87 28.19,62.64 32.77,62.64 32.92,62.48 32.92,61.72 ADC4.AIN_1P
OUT30
  Top 0.152: U$8.OUTB 19.81,61.87 21.03,61.87 U$8.-INB 21.18,61.87 21.49,62.18 21.49,66.9 22.4,67.82 28.65,67.82 33.98,62.48 33.98,61.72 ADC4.AIN_0P
OUT31  (via drill 0.35)
  Top 0.152: U$8.OUTC 19.81,56.54 21.03,56.54 U$8.-INC 21.18,56.54 21.34,56.69 v21.34,57.91 | v33.22,57.61 33.98,56.84 33.98,56.08 ADC4.AIN_3P
  Bottom 0.152: v33.22,57.61 21.64,57.61 v21.34,57.91
OUT32
  Top 0.152: U$8.-IND 26.21,56.54 27.28,56.54 U$8.OUTD 27.43,56.54 28.04,57.15 32.61,57.15 32.92,56.84 32.92,56.08 ADC4.AIN_2P
REFCAP1
  Top 0.152: 44.5,59.28 39.93,59.28 38.56,60.66 38.56,61.57 ADC4.REFCAP | 44.5,59.28 45.57,60.35 C1.1 | 44.5,59.28 45.57,58.22 45.57,55.63 C2.1
REFCAP2
  Top 0.152: ADC1.REFCAP 38.56,44.5 38.56,43.59 42.67,39.47 44.2,39.47 44.65,39.01 44.65,35.2 45.41,34.44 46.02,34.44 46.63,35.05 46.63,39.47 45.72,40.39 C5.1 45.72,40.54 45.72,45.41 C4.1
REFCAP3
  Top 0.152: ADC2.REFCAP 38.56,27.43 38.56,26.67 39.78,25.45 45.57,25.45 C8.1 45.72,25.6 45.72,30.48 C7.1
REFCAP4  (via drill 0.35)
  Top 0.152: v39.93,15.39 38.56,14.02 38.56,10.52 ADC3.REFCAP | C11.1 45.72,10.52 45.72,15.39 C10.1
  Bottom 0.152: v39.93,15.39 45.57,15.39 C10.1
REFIO1
  Top 0.152: ADC4.REFIO 39.47,61.72 39.47,62.33 40.08,62.94 45.11,62.94 46.94,61.11 46.94,51.82 45.72,50.6 C3.1
REFIO2
  Top 0.152: ADC1.REFIO 39.47,44.5 39.47,43.74 43.43,39.78 44.35,39.78 45.57,38.56 45.57,35.51 C6.1
REFIO3  (via drill 0.35)
  Top 0.152: v39.78,32.46 39.47,32.16 39.47,27.58 ADC2.REFIO
  Bottom 0.152: v39.78,32.46 39.78,26.36 45.57,20.57 C9.1
REFIO4
  Top 0.152: ADC3.REFIO 39.47,10.36 39.47,9.75 41.3,7.92 43.28,7.92 45.57,5.64 C12.1
RST  (via drill 0.35)
  Top 0.152: v44.5,23.47 44.5,14.48 44.2,14.17 43.89,14.17 41,11.28 41,10.52 ADC3.RST/PD | ADC2.RST/PD 41,27.58 41,28.35 43.74,31.09 v43.74,31.39 43.74,31.7 46.94,34.9 46.94,45.72 46.18,46.48 44.81,46.48 41.76,43.43 41.3,43.43 41,43.74 41,44.5 ADC1.RST/PD 41,44.65 41,45.41 44.81,49.23 51.51,49.23 52.73,50.44 53.19,50.44 54.25,51.51 54.25,55.47 55.32,56.54 JP5.37 | v44.04,59.89 41.91,59.89 41,60.81 ADC4.RST/PD
  Bottom 0.152: v44.5,23.47 44.5,24.69 43.43,25.76 43.43,31.09 v43.74,31.39 | v44.04,59.89 44.96,59.89 47.09,57.76 54.25,57.76 55.32,56.69 JP5.37